# Altium project BTCUOIKICADCAM.PrjPcb
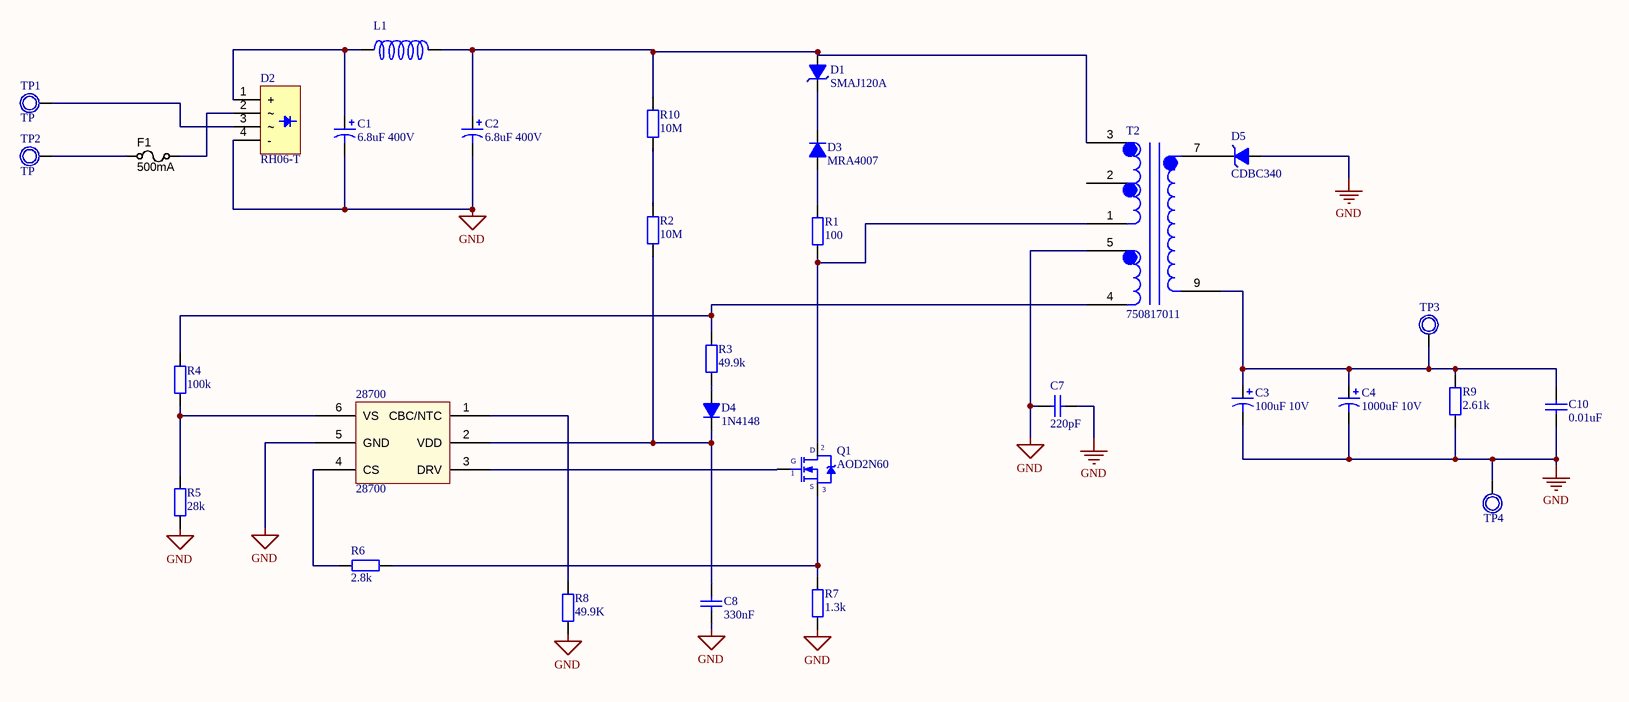
[diagram p0: SCHcadcamcuoiki.SchDoc]
1 sheet, 31 parts. Net scope: global (net labels, ports and power ports of the same name join across sheets).
Board file: PCBcadcamcuoiki.PcbDoc

## Sheet SCHcadcamcuoiki.SchDoc
size D; SheetNumber: 1; SheetTotal: 1

### Parts
28700  28700  [SOT23(1)]
C1  6.8uF 400V  [C3MM]
C2  6.8uF 400V  [C3MM]
C3  100uF 10V  [C5mm]
C4  1000uF 10V  [C5mm]
C7  220pF  [tu tantalum dip5.08]
C8  330nF  [Tu tantalum dip5.08]
C10  0.01uF  [tu gom]
D1  SMAJ120A  [DIODE ZENNER SMD SOD80]
D2  RH06-T  [DIODE CAU 10A CAM]
D3  MRA4007  [DIODE 7A]
D4  1N4148  [DIODE 0.5A]
D5  CDBC340  [DIODE ZENNER SMD SOD80]
F1  value 500mA  [RESC1608X55N]  (hidden comment: Fast Acting)
L1  (no value)  [CUON CAM 200mil]
Q1  AOD2N60  [QTO-220]
R1  100  [tro vach 1/4w]
R2  10M  [tro vach 1/4w]
R3  49.9k  [tro vach 1/4w]
R4  100k  [tro vach 1/4w]
R5  28k  [tro vach 1/4w]
R6  2.8k  [tro vach 1/4w]
R7  1.3k  [tro vach 1/4w]
R8  49.9K  [tro vach 1/4w]
R9  2.61k  [tro vach 1/4w]
R10  10M  [tro vach 1/4w]
T2  750817011  [750817011]
TP1  TP  [TP1]
TP2  TP  [TP1]
TP3  (no value)  [TP1]
TP4  (no value)  [TP1]

### Nets
GND: 28700.5(GND) C1.2 C2.2 C3.2 C4.2 C7.1 C7.2 C8.2 C10.2 D2.4(-) D5.1(A) R5.1 R7.1 R8.1 R9.1 T2.5 TP4.1
Net28700_1: 28700.1(CBC/NTC) R8.2
Net28700_2: 28700.2(VDD) C8.1 D4.2(K) R2.1
Net28700_3: 28700.3(DRV) Q1.1(G)
Net28700_4: 28700.4(CS) R6.1
Net28700_6: 28700.6(VS) R4.1 R5.2
NetC1_1: C1.1 D2.1(+) L1.1
NetC2_1: C2.1 D1.1(A) L1.2 R10.2 T2.3
NetC3_1: C3.1 C4.1 C10.1 R9.2 T2.9 TP3.1
NetD1_2: D1.2(K) D3.2(K)
NetD2_2: D2.2 F1.2
NetD2_3: D2.3 TP1.1
NetD3_1: D3.1(A) R1.2
NetD4_1: D4.1(A) R3.1
NetD5_2: D5.2(K) T2.7
NetF1_1: F1.1 TP2.1
NetQ1_2: Q1.2(D) R1.1 T2.1
NetQ1_3: Q1.3(S) R6.2 R7.2
NetR2_2: R2.2 R10.1
NetR3_2: R3.2 R4.2 T2.4

Not connected (* = marked no-connect by the designer): T2 2

### Notes on the sheet
- THIS DOCUMENT AND THE DATA DISCLOSED HEREIN OR
- HEREWITH IS THE PROPERTY OF ALTIUM LIMITED AND MAY
- DWG NO:
- REVISION
- REV:
- DESCRIPTION
- DATE
- APPROVED
- BE FREELY DISTRIBUTED IN WHOLE. NO RIGHTS ARE
- RESERVED OR EXPRESS OR IMPLIED WARANTEE GIVEN.
- ENG:
- APPROVALS
- PROJECT
- DSN:
- CHK:
- REFERENCE DOCUMENTS
- PROJECT REVISION:
- TITLE
- DOCUMENT REVISION:
- DESIGN ITEM:
- BOM:
- FAB DWG:
- PCB DWG:
- ASSY DWG:
- SCALE:
- A3
- SIZE
- CAGE CODE
- FILE NAME
- DWG NO.
- SHEET
- OF
- REV

### Library data of the parts
C1 C2 = Cap Pol 3mm: Polarized Capacitor (Axial); Published: 8-Jun-2000; LatestRevisionDate: 17-Jul-2002; LatestRevisionNote: Re-released for DXP Platform.; PackageReference: POLAR0.8; Publisher: Altium Limited
C3 C4 = Cap Pol 5mm: Polarized Capacitor (Axial); Published: 8-Jun-2000; LatestRevisionDate: 17-Jul-2002; LatestRevisionNote: Re-released for DXP Platform.; PackageReference: POLAR0.8; Publisher: Altium Limited
C7 = Tu tantalum 220pF 50V 5% DIP5.08: Cắm; Don_Vi: Con; So_Chan: 2; Ten_Linh_Kien: Tụ tantalum 221-220P 50V 5% DIP5.08 (sứ vàng-10PCS); Ma_Hang: MH008696; Chung_Loai: Cắm; Kieu_Chan: *
C8 = Tu tantalum 330nF 50V 20% DIP5.08: Cắm; Don_Vi: Con; So_Chan: 2; Ten_Linh_Kien: Tụ tantalum 334-330nF 50V 20% DIP5.08 (sứ vàng) (10PCS); Ma_Hang: MH003963; Chung_Loai: Cắm; Kieu_Chan: *
C10 = Tu gom 100 50V: Cắm; Don_Vi: Con; So_Chan: 2; Ten_Linh_Kien: Tụ gốm 100 10pF 50V; Ma_Hang: MH004765; Chung_Loai: Cắm; Kieu_Chan: *
D1 D5 = Diode Zener 24V: Cắm; Don_Vi: Con; Ten_Linh_Kien: Diode Zener 1/2W 24V DIP 1N5252B; Ma_Hang: MH002878; Ghi_Chu: *; Kieu_Chan: *; Chung_Loai: Cắm
D2 = Diode CAU 10A: Cắm; Ten_Linh_Kien: Diode Cầu 10A 1000V KBU1010; Don_Vi: Con; Ma_Hang: MH004295; Ghi_Chu: *; Kieu_Chan: *; Chung_Loai: cắm
D3 = Diode 6A 1000V: Cắm; Ten_Linh_Kien: Diode 6A10 6A 1000V (DIP); Don_Vi: Con; Ma_Hang: MH006103; Ghi Chu: *; Kieu_Chan: *; Chung_Loai: Cắm
D4 = Diode 1N4148: Cắm; Ten_Linh_Kien: Diode 1N4148 DO35 450mA 100V ( 1N4148 DIP); Don_Vi: Con; Ma_Hang: MH001065; Ghi Chu: *; Kieu_Chan: *; Chung_Loai: Cắm
F1 = FUSE_FAST_500mA_0603: Fuse 500mA 32VDC 0603 SMD; Manufacturer 1: AVX Corporation; Manufacturer Part Number 1: F0603E0R50FSTR; Ratings: 500mA; 32VDC; fast acting; DC Cold Resistance: 0.25 Ohm; SCDType: source; Package / Case: 0603 (1608 metric); Fuse Type: Fast Acting; ComponentLink1URL: http://www.avx.com/docs/Catalogs/accug2.pdf; ComponentLink1Description: http://www.avx.com/docs/Catalogs/accug2.pdf; Supplier 1: Digi-Key; Supplier Part Number 1: 478-2860-1-ND; Operating Temperature: -55°C ~ 125°C
L1 = Conductor
Q1 = IRF840: MOSFET N - CHANNEL 500V - 0.75 - 8A - TO-220; Value: IRF840
R1 R4 = Tro Vach 1/4W 5% 100k: Cắm; Don_Vi: Con; So_Chan: 2; Ten_Linh_Kien: Trở Vạch 1/4w 5% 100k; Ma_Hang: MH007352; Chung_Loai: Cắm; Kieu_Chan: *
R2 R10 = Tro Vach 1/4W 5% 10M: Cắm; Don_Vi: Con; So_Chan: 2; Ten_Linh_Kien: Trở Vạch 1/4w 5% 10M; Ma_Hang: MH007385; Chung_Loai: Cắm; Kieu_Chan: *
R3 R8 = Tro Vach 1/4W 5% 51k: Cắm; So_Chan: 2; Don_Vi: Con; Ten_Linh_Kien: Trở Vạch 1/4w 5% 51k; Ma_Hang: MH007326; Chung_Loai: Cắm; Kieu_Chan: *
R5 = Tro Vach 1/4W 5% 30k: Cắm; Don_Vi: Con; So_Chan: 2; Ten_Linh_Kien: Trở Vạch 1/4w 5% 30k; Ma_Hang: MH007310; Chung_Loai: Cắm; Kieu_Chan: *
R6 = Tro Vach 1/4W 1% 3k: Cắm; Don_Vi: Con; So_Chan: 2; Ten_Linh_Kien: Trở Vạch 1/4W 1% 3k; Ma_Hang: MH008834; Chung_Loai: Cắm; Kieu_Chan: *
R7 = Tro Vach 1/4W 5% 1.5k: Cắm; Don_Vi: Con; So_Chan: 2; Ten_Linh_Kien: Trở Vạch 1/4w 5% 1.5k; Ma_Hang: MH007284; Chung_Loai: Cắm; Kieu_Chan: *
R9 = Tro Vach 1/4W 5% 2.7k: Cắm; Don_Vi: Con; So_Chan: 2; Ten_Linh_Kien: Trở Vạch 1/4w 5% 2.7k; Ma_Hang: MH007294; Chung_Loai: Cắm; Kieu_Chan: *
TP1-TP4 = TP1: Test Point; Value: Test Point
28700 = 28700: Parameter 1: *